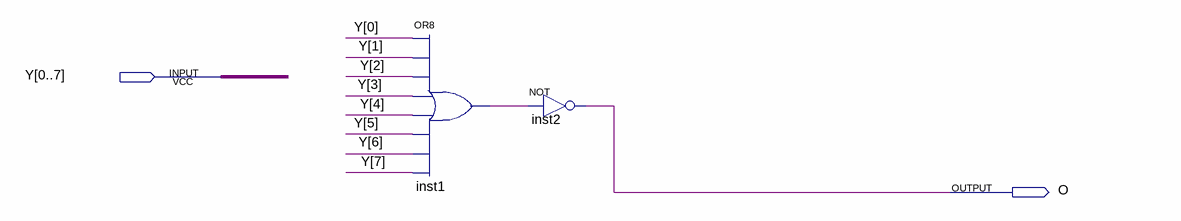
[diagram p0: schematic sheet]
// Quartus schematic nor8bit.bdf as structural Verilog: 2 symbols, 2 pins
module nor8bit (
  input  [0:7] Y,
  output O
);

  wire inst1_out;

  or inst1 (inst1_out, Y[0], Y[1], Y[2], Y[3], Y[4], Y[5], Y[6], Y[7]);
  not inst2 (O, inst1_out);
endmodule
